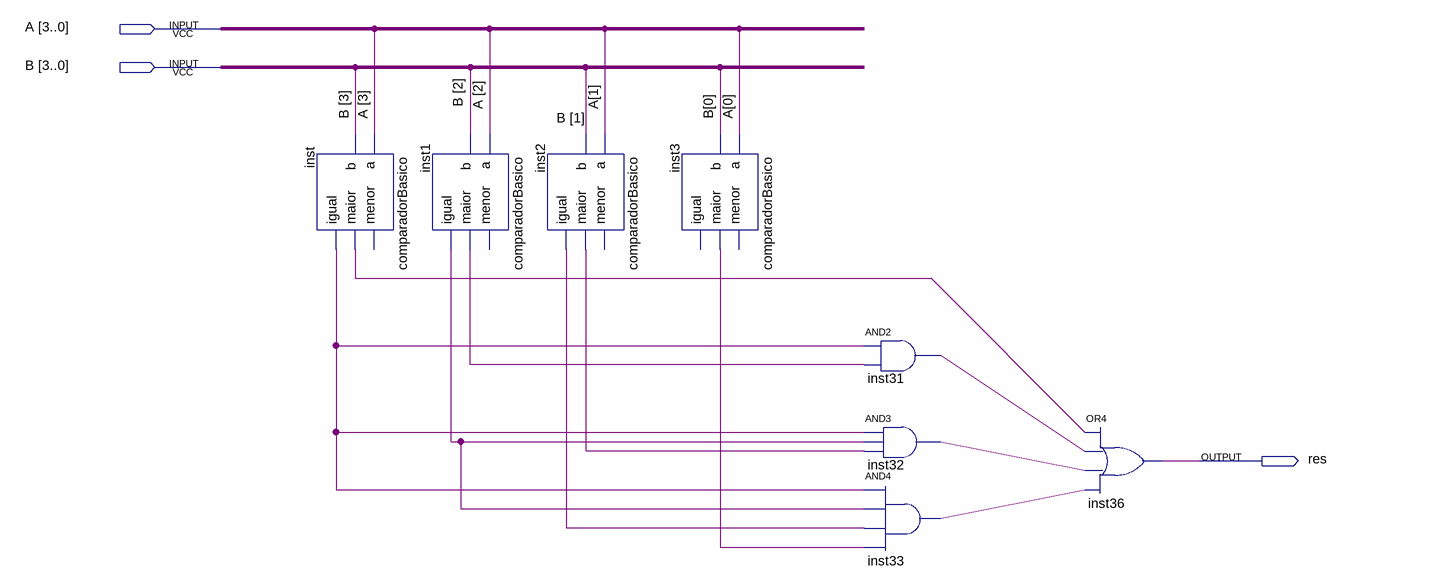
[diagram p0: schematic sheet]
// Quartus schematic maiorModulo.bdf as structural Verilog: 8 symbols, 3 pins
module maiorModulo (
  input  [3:0] A,
  input  [3:0] B,
  output res
);

  wire inst1_igual, inst1_maior, inst2_igual, inst2_maior, inst3_maior, inst31_out, inst32_out, inst33_out,
       inst_igual, inst_maior;

  comparadorBasico inst (.a(A[3]), .b(B[3]), .maior(inst_maior), .igual(inst_igual));  // open: menor
  comparadorBasico inst1 (.a(A[2]), .b(B[2]), .maior(inst1_maior), .igual(inst1_igual));  // open: menor
  comparadorBasico inst2 (.a(A[1]), .b(B[1]), .maior(inst2_maior), .igual(inst2_igual));  // open: menor
  comparadorBasico inst3 (.a(A[0]), .b(B[0]), .maior(inst3_maior));  // open: menor, igual
  and inst31 (inst31_out, inst_igual, inst1_maior);
  and inst32 (inst32_out, inst_igual, inst1_igual, inst2_maior);
  and inst33 (inst33_out, inst_igual, inst1_igual, inst2_igual, inst3_maior);
  or inst36 (res, inst_maior, inst31_out, inst32_out, inst33_out);
endmodule
